# EAGLE schematic DeMux3 (EAGLE 6.6.0)

## Sheet 1 of 3
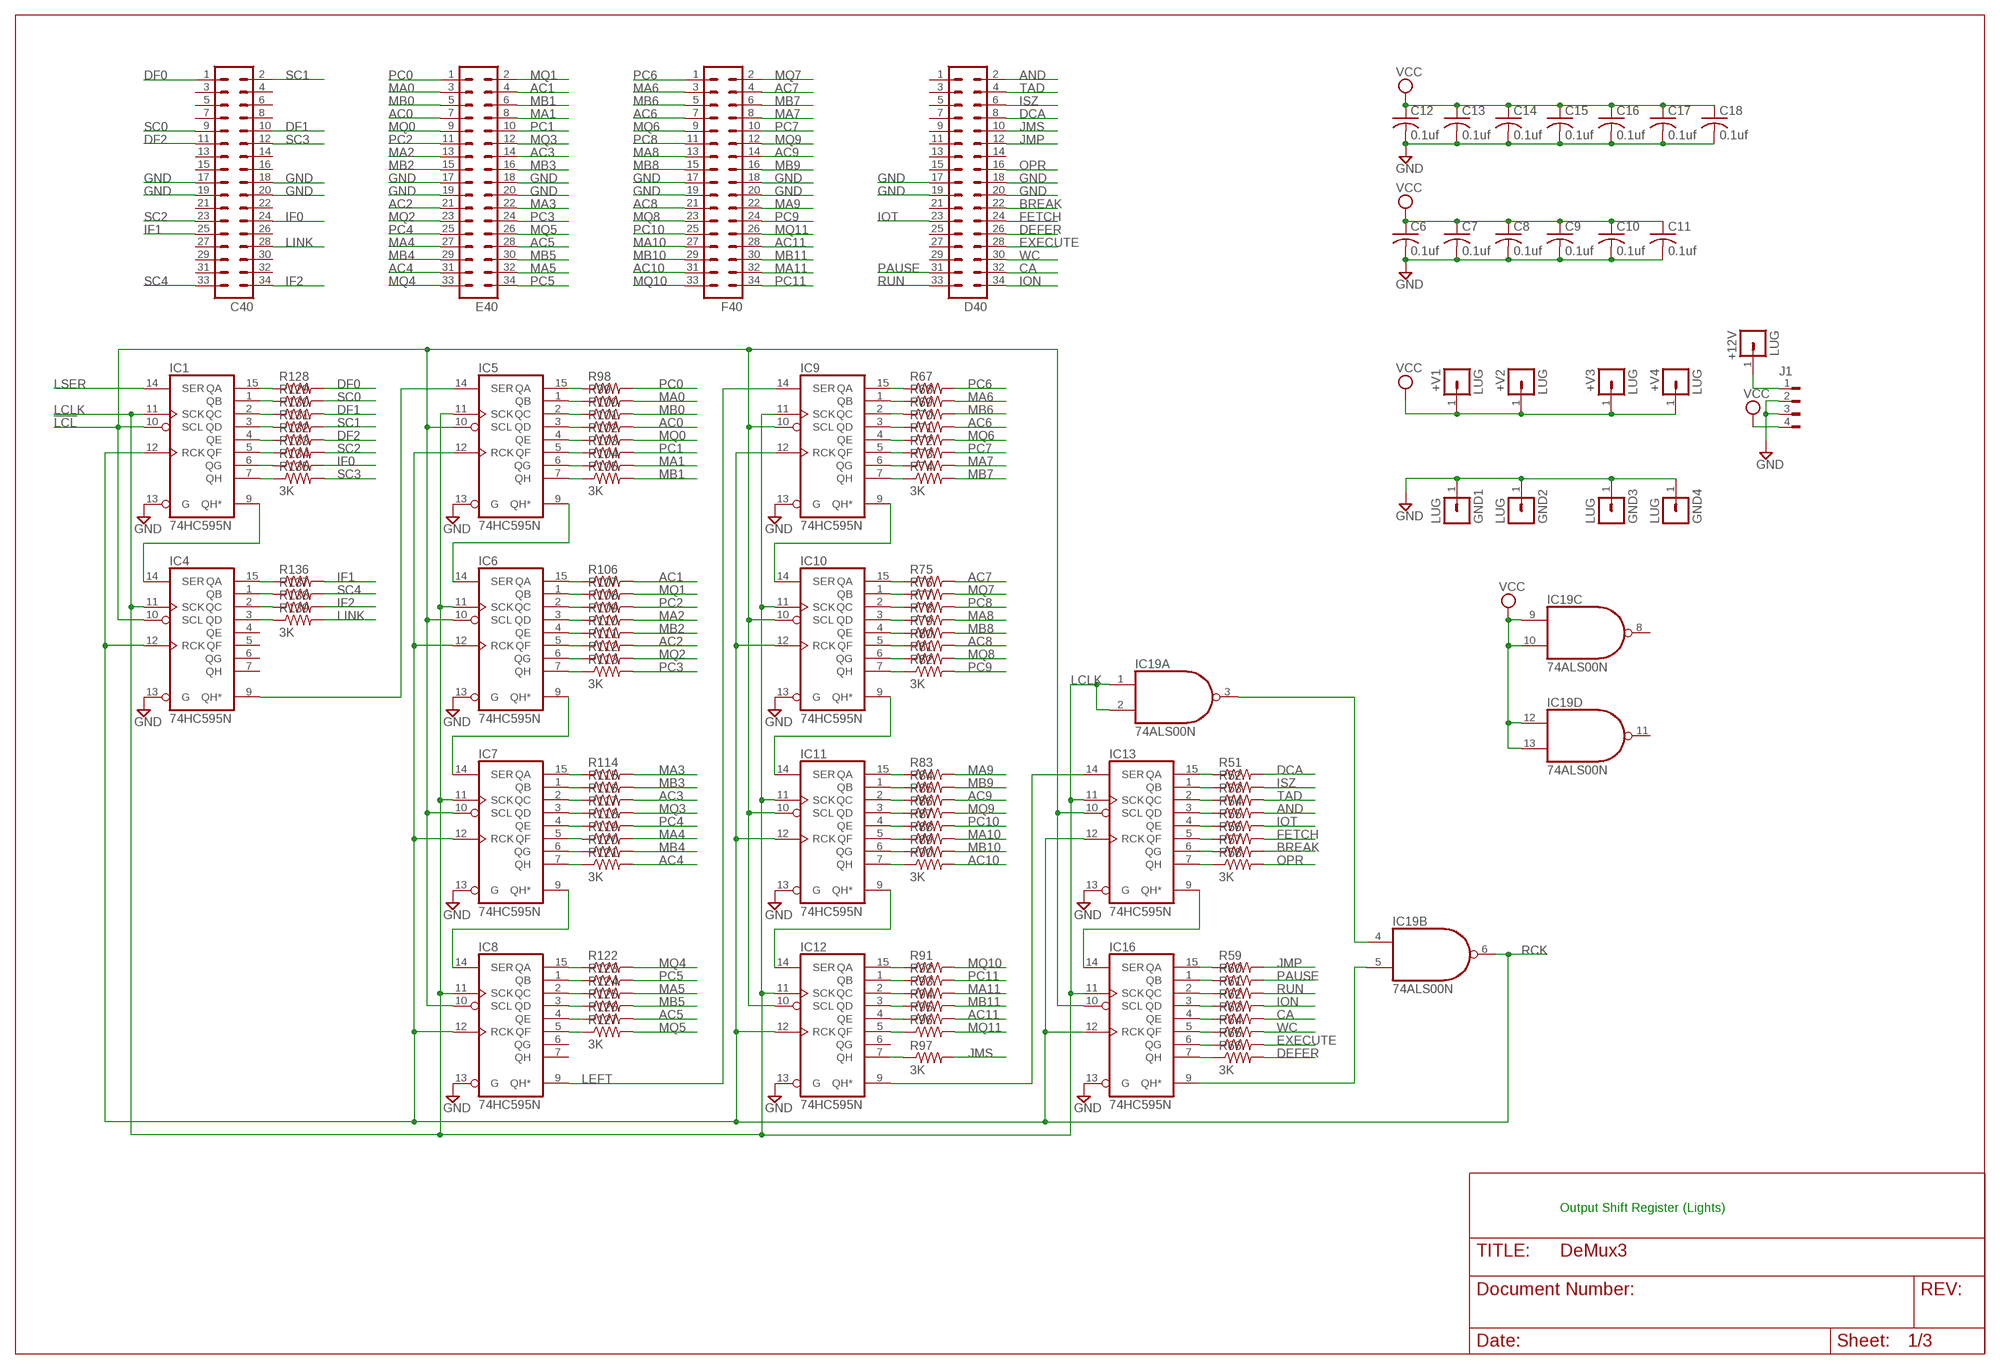
[diagram p0: schematic, sheet 1]

### Parts
+12V  LUG  [SPADELUG]
+V1  LUG  [SPADELUG]
+V2  LUG  [SPADELUG]
+V3  LUG  [SPADELUG]
+V4  LUG  [SPADELUG]
C6  0.1uf  C-US050-025X075  [C050-025X075]
C7  0.1uf  C-US050-025X075  [C050-025X075]
C8  0.1uf  C-US050-025X075  [C050-025X075]
C9  0.1uf  C-US050-025X075  [C050-025X075]
C10  0.1uf  C-US050-025X075  [C050-025X075]
C11  0.1uf  C-US050-025X075  [C050-025X075]
C12  0.1uf  C-US050-025X075  [C050-025X075]
C13  0.1uf  C-US050-025X075  [C050-025X075]
C14  0.1uf  C-US050-025X075  [C050-025X075]
C15  0.1uf  C-US050-025X075  [C050-025X075]
C16  0.1uf  C-US050-025X075  [C050-025X075]
C17  0.1uf  C-US050-025X075  [C050-025X075]
C18  0.1uf  C-US050-025X075  [C050-025X075]
C40  MA17-2  [MA17-2]
D40  MA17-2  [MA17-2]
E40  MA17-2  [MA17-2]
F40  MA17-2  [MA17-2]
GND1  LUG  [SPADELUG]
GND2  LUG  [SPADELUG]
GND3  LUG  [SPADELUG]
GND4  LUG  [SPADELUG]
IC1  74HC595N  74LS595N  [DIL16]
IC4  74HC595N  74LS595N  [DIL16]
IC5  74HC595N  74LS595N  [DIL16]
IC6  74HC595N  74LS595N  [DIL16]
IC7  74HC595N  74LS595N  [DIL16]
IC8  74HC595N  74LS595N  [DIL16]
IC9  74HC595N  74LS595N  [DIL16]
IC10  74HC595N  74LS595N  [DIL16]
IC11  74HC595N  74LS595N  [DIL16]
IC12  74HC595N  74LS595N  [DIL16]
IC13  74HC595N  74LS595N  [DIL16]
IC16  74HC595N  74LS595N  [DIL16]
IC19  74ALS00N  [DIL14]
J1  FLOPPY-4  [FLOPPY-4]
R51  R-US_0207/10  [0207/10]
R52  R-US_0207/10  [0207/10]
R53  R-US_0207/10  [0207/10]
R54  R-US_0207/10  [0207/10]
R55  R-US_0207/10  [0207/10]
R56  R-US_0207/10  [0207/10]
R57  R-US_0207/10  [0207/10]
R58  3K  R-US_0207/10  [0207/10]
R59  R-US_0207/10  [0207/10]
R60  R-US_0207/10  [0207/10]
R61  R-US_0207/10  [0207/10]
R62  R-US_0207/10  [0207/10]
R63  R-US_0207/10  [0207/10]
R64  R-US_0207/10  [0207/10]
R65  R-US_0207/10  [0207/10]
R66  3K  R-US_0207/10  [0207/10]
R67  R-US_0207/10  [0207/10]
R68  R-US_0207/10  [0207/10]
R69  R-US_0207/10  [0207/10]
R70  R-US_0207/10  [0207/10]
R71  R-US_0207/10  [0207/10]
R72  R-US_0207/10  [0207/10]
R73  R-US_0207/10  [0207/10]
R74  3K  R-US_0207/10  [0207/10]
R75  R-US_0207/10  [0207/10]
R76  R-US_0207/10  [0207/10]
R77  R-US_0207/10  [0207/10]
R78  R-US_0207/10  [0207/10]
R79  R-US_0207/10  [0207/10]
R80  R-US_0207/10  [0207/10]
R81  R-US_0207/10  [0207/10]
R82  3K  R-US_0207/10  [0207/10]
R83  R-US_0207/10  [0207/10]
R84  R-US_0207/10  [0207/10]
R85  R-US_0207/10  [0207/10]
R86  R-US_0207/10  [0207/10]
R87  R-US_0207/10  [0207/10]
R88  R-US_0207/10  [0207/10]
R89  R-US_0207/10  [0207/10]
R90  3K  R-US_0207/10  [0207/10]
R91  R-US_0207/10  [0207/10]
R92  R-US_0207/10  [0207/10]
R93  R-US_0207/10  [0207/10]
R94  R-US_0207/10  [0207/10]
R95  R-US_0207/10  [0207/10]
R96  R-US_0207/10  [0207/10]
R97  3K  R-US_0207/10  [0207/10]
R98  R-US_0207/10  [0207/10]
R99  R-US_0207/10  [0207/10]
R100  R-US_0207/10  [0207/10]
R101  R-US_0207/10  [0207/10]
R102  R-US_0207/10  [0207/10]
R103  R-US_0207/10  [0207/10]
R104  R-US_0207/10  [0207/10]
R105  3K  R-US_0207/10  [0207/10]
R106  R-US_0207/10  [0207/10]
R107  R-US_0207/10  [0207/10]
R108  R-US_0207/10  [0207/10]
R109  R-US_0207/10  [0207/10]
R110  R-US_0207/10  [0207/10]
R111  R-US_0207/10  [0207/10]
R112  R-US_0207/10  [0207/10]
R113  3K  R-US_0207/10  [0207/10]
R114  R-US_0207/10  [0207/10]
R115  R-US_0207/10  [0207/10]
R116  R-US_0207/10  [0207/10]
R117  R-US_0207/10  [0207/10]
R118  R-US_0207/10  [0207/10]
R119  R-US_0207/10  [0207/10]
R120  R-US_0207/10  [0207/10]
R121  3K  R-US_0207/10  [0207/10]
R122  R-US_0207/10  [0207/10]
R123  R-US_0207/10  [0207/10]
R124  R-US_0207/10  [0207/10]
R125  R-US_0207/10  [0207/10]
R126  R-US_0207/10  [0207/10]
R127  3K  R-US_0207/10  [0207/10]
R128  R-US_0207/10  [0207/10]
R129  R-US_0207/10  [0207/10]
R130  R-US_0207/10  [0207/10]
R131  R-US_0207/10  [0207/10]
R132  R-US_0207/10  [0207/10]
R133  R-US_0207/10  [0207/10]
R134  R-US_0207/10  [0207/10]
R135  3K  R-US_0207/10  [0207/10]
R136  R-US_0207/10  [0207/10]
R137  R-US_0207/10  [0207/10]
R138  R-US_0207/10  [0207/10]
R139  3K  R-US_0207/10  [0207/10]

### Nets
!LCL: IC1.10(SCL) IC4.10(SCL) IC5.10(SCL) IC6.10(SCL) IC7.10(SCL) IC8.10(SCL) IC9.10(SCL) IC10.10(SCL) IC11.10(SCL) IC12.10(SCL) IC13.10(SCL) IC16.10(SCL) ; also sheet 3
+12V [supply]: +12V.1 J1.1
AC0: E40.7 R101.2
AC1: E40.4 R106.2
AC2: E40.21 R111.2
AC3: E40.14 R116.2
AC4: E40.31 R121.2
AC5: E40.28 R126.2
AC6: F40.7 R70.2
AC7: F40.4 R75.2
AC8: F40.21 R80.2
AC9: F40.14 R85.2
AC10: F40.31 R90.2
AC11: F40.28 R95.2
AND: D40.2 R54.2
BREAK: D40.22 R57.2
CA: D40.32 R63.2
DCA: D40.8 R51.2
DEFER: D40.26 R66.2
DF0: C40.1 R128.2
DF1: C40.10 R130.2
DF2: C40.11 R132.2
EXECUTE: D40.28 R65.2
FETCH: D40.24 R56.2
GND [supply]: C6.2 C7.2 C8.2 C9.2 C10.2 C11.2 C12.2 C13.2 C14.2 C15.2 C16.2 C17.2 C18.2 C40.17 C40.18 C40.19 C40.20 D40.17 D40.18 D40.19 D40.20 E40.17 E40.18 E40.19 E40.20 F40.17 F40.18 F40.19 F40.20 GND1.1 GND2.1 GND3.1 GND4.1 IC1.13(G) IC4.13(G) IC5.13(G) IC6.13(G) IC7.13(G) IC8.13(G) IC9.13(G) IC10.13(G) IC11.13(G) IC12.13(G) IC13.13(G) IC16.13(G) J1.2 J1.3 ; also sheet 2,3
IF0: C40.24 R134.2
IF1: C40.25 R136.2
IF2: C40.34 R138.2
ION: D40.34 R62.2
IOT: D40.23 R55.2
ISZ: D40.6 R52.2
JMP: D40.12 R59.2
JMS: D40.10 R97.2
LCLK: IC1.11(SCK) IC4.11(SCK) IC5.11(SCK) IC6.11(SCK) IC7.11(SCK) IC8.11(SCK) IC9.11(SCK) IC10.11(SCK) IC11.11(SCK) IC12.11(SCK) IC13.11(SCK) IC16.11(SCK) IC19.1(A:I0) IC19.2(A:I1) ; also sheet 3
LEFT: IC8.9(QH*) IC9.14(SER) ; also sheet 3
LINK: C40.28 R139.2
LSER: IC1.14(SER) ; also sheet 3
MA0: E40.3 R99.2
MA1: E40.8 R104.2
MA2: E40.13 R109.2
MA3: E40.22 R114.2
MA4: E40.27 R119.2
MA5: E40.32 R124.2
MA6: F40.3 R68.2
MA7: F40.8 R73.2
MA8: F40.13 R78.2
MA9: F40.22 R83.2
MA10: F40.27 R88.2
MA11: F40.32 R93.2
MB0: E40.5 R100.2
MB1: E40.6 R105.2
MB2: E40.15 R110.2
MB3: E40.16 R115.2
MB4: E40.29 R120.2
MB5: E40.30 R125.2
MB6: F40.5 R69.2
MB7: F40.6 R74.2
MB8: F40.15 R79.2
MB9: F40.16 R84.2
MB10: F40.29 R89.2
MB11: F40.30 R94.2
MQ0: E40.9 R102.2
MQ1: E40.2 R107.2
MQ2: E40.23 R112.2
MQ3: E40.12 R117.2
MQ4: E40.33 R122.2
MQ5: E40.26 R127.2
MQ6: F40.9 R71.2
MQ7: F40.2 R76.2
MQ8: F40.23 R81.2
MQ9: F40.12 R86.2
MQ10: F40.33 R91.2
MQ11: F40.26 R96.2
N$4: IC5.9(QH*) IC6.14(SER)
N$10: IC1.9(QH*) IC4.14(SER)
N$13: IC7.9(QH*) IC8.14(SER)
N$14: IC6.9(QH*) IC7.14(SER)
N$15: IC11.9(QH*) IC12.14(SER)
N$16: IC10.9(QH*) IC11.14(SER)
N$17: IC13.9(QH*) IC16.14(SER)
N$19: IC9.9(QH*) IC10.14(SER)
N$21: IC4.9(QH*) IC5.14(SER)
N$22: IC16.9(QH*) IC19.5(B:I1)
N$23: IC12.9(QH*) IC13.14(SER)
N$24: IC13.15(QA) R51.1
N$25: IC13.1(QB) R52.1
N$26: IC13.2(QC) R53.1
N$27: IC19.3(A:O) IC19.4(B:I0)
N$32: IC13.3(QD) R54.1
N$33: IC13.4(QE) R55.1
N$34: IC13.5(QF) R56.1
N$35: IC13.6(QG) R57.1
N$36: IC13.7(QH) R58.1
N$37: IC16.15(QA) R59.1
N$38: IC16.1(QB) R60.1
N$39: IC16.2(QC) R61.1
N$40: IC16.3(QD) R62.1
N$41: IC16.4(QE) R63.1
N$42: IC16.5(QF) R64.1
N$43: IC16.6(QG) R65.1
N$44: IC16.7(QH) R66.1
N$45: IC9.15(QA) R67.1
N$46: IC9.1(QB) R68.1
N$47: IC9.2(QC) R69.1
N$48: IC9.3(QD) R70.1
N$49: IC9.4(QE) R71.1
N$50: IC9.5(QF) R72.1
N$51: IC9.6(QG) R73.1
N$57: IC9.7(QH) R74.1
N$58: IC12.7(QH) R97.1
N$59: IC12.5(QF) R96.1
N$60: IC12.4(QE) R95.1
N$61: IC12.3(QD) R94.1
N$62: IC12.2(QC) R93.1
N$63: IC12.1(QB) R92.1
N$64: IC12.15(QA) R91.1
N$65: IC10.15(QA) R75.1
N$66: IC10.1(QB) R76.1
N$67: IC10.2(QC) R77.1
N$68: IC10.3(QD) R78.1
N$69: IC10.4(QE) R79.1
N$70: IC10.5(QF) R80.1
N$71: IC10.6(QG) R81.1
N$72: IC10.7(QH) R82.1
N$73: IC11.15(QA) R83.1
N$74: IC11.1(QB) R84.1
N$75: IC11.3(QD) R86.1
N$76: IC11.2(QC) R85.1
N$77: IC11.4(QE) R87.1
N$78: IC11.5(QF) R88.1
N$79: IC11.6(QG) R89.1
N$80: IC11.7(QH) R90.1
N$81: IC8.5(QF) R127.1
N$82: IC8.4(QE) R126.1
N$83: IC8.3(QD) R125.1
N$84: IC8.2(QC) R124.1
N$85: IC8.1(QB) R123.1
N$86: IC8.15(QA) R122.1
N$87: IC7.7(QH) R121.1
N$88: IC7.6(QG) R120.1
N$89: IC7.5(QF) R119.1
N$90: IC7.4(QE) R118.1
N$91: IC7.3(QD) R117.1
N$92: IC7.2(QC) R116.1
N$93: IC7.1(QB) R115.1
N$94: IC7.15(QA) R114.1
N$95: IC5.15(QA) R98.1
N$96: IC5.1(QB) R99.1
N$97: IC5.2(QC) R100.1
N$98: IC5.3(QD) R101.1
N$99: IC5.4(QE) R102.1
N$100: IC5.5(QF) R103.1
N$101: IC5.6(QG) R104.1
N$102: IC5.7(QH) R105.1
N$103: IC6.15(QA) R106.1
N$104: IC6.1(QB) R107.1
N$105: IC6.2(QC) R108.1
N$106: IC6.3(QD) R109.1
N$107: IC6.4(QE) R110.1
N$108: IC6.5(QF) R111.1
N$109: IC6.6(QG) R112.1
N$110: IC6.7(QH) R113.1
N$111: IC1.15(QA) R128.1
N$112: IC1.1(QB) R129.1
N$113: IC1.2(QC) R130.1
N$114: IC1.3(QD) R131.1
N$115: IC1.4(QE) R132.1
N$116: IC1.5(QF) R133.1
N$117: IC1.6(QG) R134.1
N$118: IC1.7(QH) R135.1
N$119: IC4.15(QA) R136.1
N$120: IC4.3(QD) R139.1
N$121: IC4.2(QC) R138.1
N$122: IC4.1(QB) R137.1
OPR: D40.16 R58.2
PAUSE: D40.31 R60.2
PC0: E40.1 R98.2
PC1: E40.10 R103.2
PC2: E40.11 R108.2
PC3: E40.24 R113.2
PC4: E40.25 R118.2
PC5: E40.34 R123.2
PC6: F40.1 R67.2
PC7: F40.10 R72.2
PC8: F40.11 R77.2
PC9: F40.24 R82.2
PC10: F40.25 R87.2
PC11: F40.34 R92.2
RCK: IC1.12(RCK) IC4.12(RCK) IC5.12(RCK) IC6.12(RCK) IC7.12(RCK) IC8.12(RCK) IC9.12(RCK) IC10.12(RCK) IC11.12(RCK) IC12.12(RCK) IC13.12(RCK) IC16.12(RCK) IC19.6(B:O) ; also sheet 3
RUN: D40.33 R61.2
SC0: C40.9 R129.2
SC1: C40.2 R131.2
SC2: C40.23 R133.2
SC3: C40.12 R135.2
SC4: C40.33 R137.2
TAD: D40.4 R53.2
VCC [supply]: +V1.1 +V2.1 +V3.1 +V4.1 C6.1 C7.1 C8.1 C9.1 C10.1 C11.1 C12.1 C13.1 C14.1 C15.1 C16.1 C17.1 C18.1 IC19.9(C:I0) IC19.10(C:I1) IC19.12(D:I0) IC19.13(D:I1) J1.4 ; also sheet 2,3
WC: D40.30 R64.2
Unconnected: C40.3 C40.4 C40.5 C40.6 C40.7 C40.8 C40.13 C40.14 C40.15 C40.16 C40.21 C40.22 C40.26 C40.27 C40.29 C40.30 C40.31 C40.32 D40.1 D40.3 D40.5 D40.7 D40.9 D40.11 D40.13 D40.14 D40.15 D40.21 D40.25 D40.27 D40.29 IC4.4(QE) IC4.5(QF) IC4.6(QG) IC4.7(QH) IC8.6(QG) IC8.7(QH) IC12.6(QG) IC19.8(C:O) IC19.11(D:O)

### Notes on the sheet
- Output Shift Register (Lights)

## Sheet 2 of 3
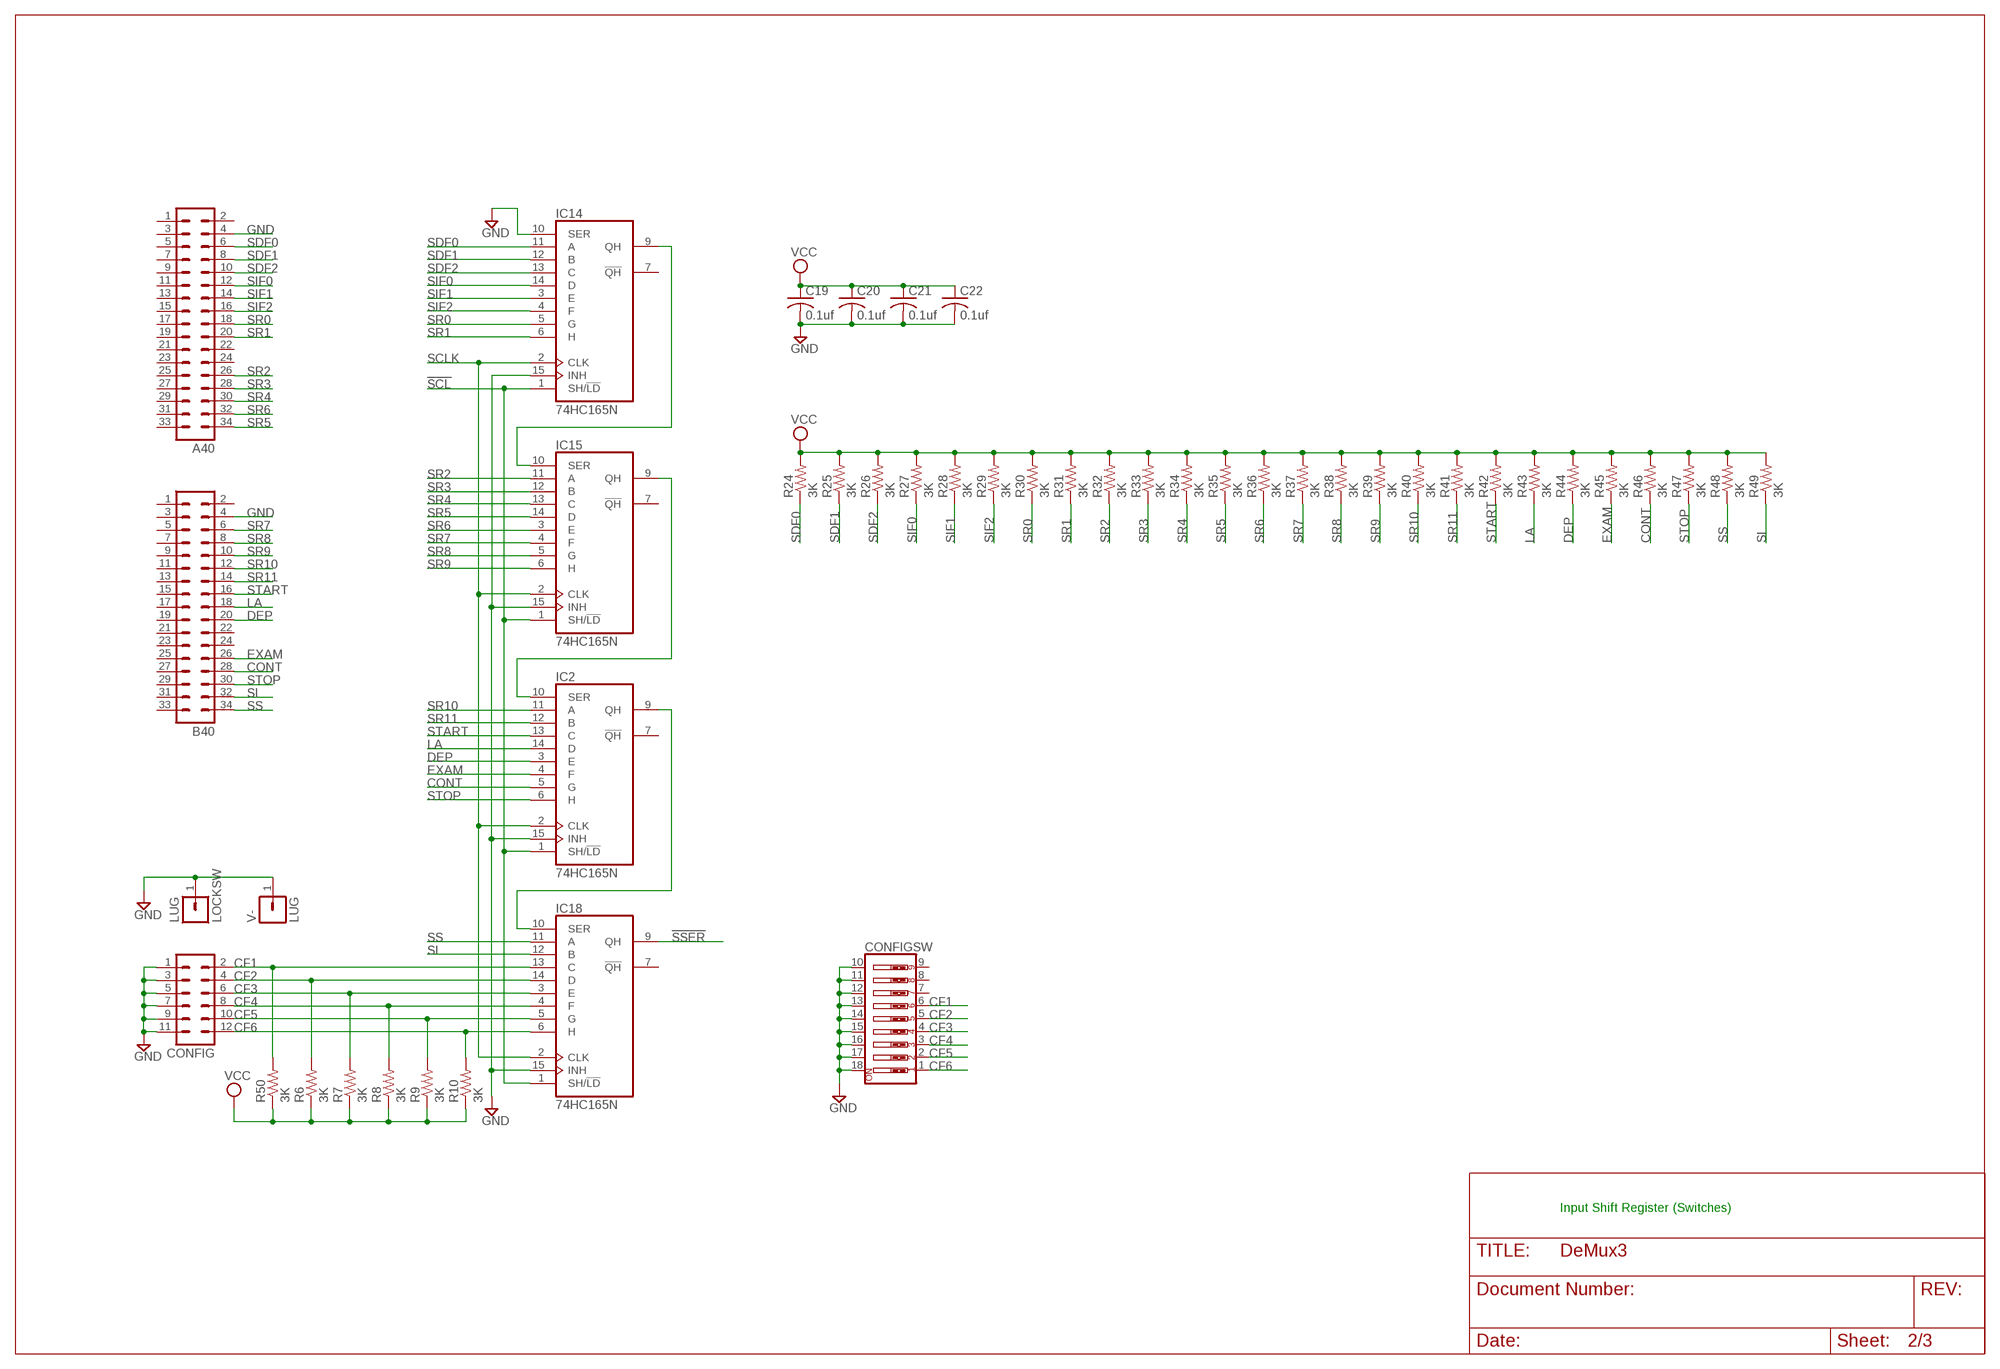
[diagram p1: schematic, sheet 2]

### Parts
A40  MA17-2  [MA17-2]
B40  MA17-2  [MA17-2]
C19  0.1uf  C-US050-025X075  [C050-025X075]
C20  0.1uf  C-US050-025X075  [C050-025X075]
C21  0.1uf  C-US050-025X075  [C050-025X075]
C22  0.1uf  C-US050-025X075  [C050-025X075]
CONFIG  MA06-2  [MA06-2]
CONFIGSW  SW_DIP-9  [EDG-09]
IC2  74HC165N  74LS165N  [DIL16]
IC14  74HC165N  74LS165N  [DIL16]
IC15  74HC165N  74LS165N  [DIL16]
IC18  74HC165N  74LS165N  [DIL16]
LOCKSW  LUG  [SPADELUG]
R6  3K  R-US_0207/10  [0207/10]
R7  3K  R-US_0207/10  [0207/10]
R8  3K  R-US_0207/10  [0207/10]
R9  3K  R-US_0207/10  [0207/10]
R10  3K  R-US_0207/10  [0207/10]
R24  3K  R-US_0207/10  [0207/10]
R25  3K  R-US_0207/10  [0207/10]
R26  3K  R-US_0207/10  [0207/10]
R27  3K  R-US_0207/10  [0207/10]
R28  3K  R-US_0207/10  [0207/10]
R29  3K  R-US_0207/10  [0207/10]
R30  3K  R-US_0207/10  [0207/10]
R31  3K  R-US_0207/10  [0207/10]
R32  3K  R-US_0207/10  [0207/10]
R33  3K  R-US_0207/10  [0207/10]
R34  3K  R-US_0207/10  [0207/10]
R35  3K  R-US_0207/10  [0207/10]
R36  3K  R-US_0207/10  [0207/10]
R37  3K  R-US_0207/10  [0207/10]
R38  3K  R-US_0207/10  [0207/10]
R39  3K  R-US_0207/10  [0207/10]
R40  3K  R-US_0207/10  [0207/10]
R41  3K  R-US_0207/10  [0207/10]
R42  3K  R-US_0207/10  [0207/10]
R43  3K  R-US_0207/10  [0207/10]
R44  3K  R-US_0207/10  [0207/10]
R45  3K  R-US_0207/10  [0207/10]
R46  3K  R-US_0207/10  [0207/10]
R47  3K  R-US_0207/10  [0207/10]
R48  3K  R-US_0207/10  [0207/10]
R49  3K  R-US_0207/10  [0207/10]
R50  3K  R-US_0207/10  [0207/10]
V-  LUG  [SPADELUG]

### Nets
!SCL: IC2.1(SH/!LD) IC14.1(SH/!LD) IC15.1(SH/!LD) IC18.1(SH/!LD) ; also sheet 3
!SSER: IC18.9(QH) ; also sheet 3
CF1: CONFIG.2 CONFIGSW.6 IC18.13(C) R50.2
CF2: CONFIG.4 CONFIGSW.5 IC18.14(D) R6.2
CF3: CONFIG.6 CONFIGSW.4 IC18.3(E) R7.2
CF4: CONFIG.8 CONFIGSW.3 IC18.4(F) R8.2
CF5: CONFIG.10 CONFIGSW.2 IC18.5(G) R9.2
CF6: CONFIG.12 CONFIGSW.1 IC18.6(H) R10.2
CONT: B40.28 IC2.5(G) R46.1
DEP: B40.20 IC2.3(E) R44.1
EXAM: B40.26 IC2.4(F) R45.1
GND [supply]: A40.4 B40.4 C19.2 C20.2 C21.2 C22.2 CONFIG.1 CONFIG.3 CONFIG.5 CONFIG.7 CONFIG.9 CONFIG.11 CONFIGSW.10 CONFIGSW.11 CONFIGSW.12 CONFIGSW.13 CONFIGSW.14 CONFIGSW.15 CONFIGSW.16 CONFIGSW.17 CONFIGSW.18 IC2.15(INH) IC14.10(SER) IC14.15(INH) IC15.15(INH) IC18.15(INH) LOCKSW.1 V-.1 ; also sheet 1,3
LA: B40.18 IC2.14(D) R43.1
N$1: IC14.9(QH) IC15.10(SER)
N$2: IC2.10(SER) IC15.9(QH)
N$3: IC2.9(QH) IC18.10(SER)
SCLK: IC2.2(CLK) IC14.2(CLK) IC15.2(CLK) IC18.2(CLK) ; also sheet 3
SDF0: A40.6 IC14.11(A) R24.1
SDF1: A40.8 IC14.12(B) R25.1
SDF2: A40.10 IC14.13(C) R26.1
SI: B40.32 IC18.12(B) R49.1
SIF0: A40.12 IC14.14(D) R27.1
SIF1: A40.14 IC14.3(E) R28.1
SIF2: A40.16 IC14.4(F) R29.1
SR0: A40.18 IC14.5(G) R30.1
SR1: A40.20 IC14.6(H) R31.1
SR2: A40.26 IC15.11(A) R32.1
SR3: A40.28 IC15.12(B) R33.1
SR4: A40.30 IC15.13(C) R34.1
SR5: A40.34 IC15.14(D) R35.1
SR6: A40.32 IC15.3(E) R36.1
SR7: B40.6 IC15.4(F) R37.1
SR8: B40.8 IC15.5(G) R38.1
SR9: B40.10 IC15.6(H) R39.1
SR10: B40.12 IC2.11(A) R40.1
SR11: B40.14 IC2.12(B) R41.1
SS: B40.34 IC18.11(A) R48.1
START: B40.16 IC2.13(C) R42.1
STOP: B40.30 IC2.6(H) R47.1
VCC [supply]: C19.1 C20.1 C21.1 C22.1 R6.1 R7.1 R8.1 R9.1 R10.1 R24.2 R25.2 R26.2 R27.2 R28.2 R29.2 R30.2 R31.2 R32.2 R33.2 R34.2 R35.2 R36.2 R37.2 R38.2 R39.2 R40.2 R41.2 R42.2 R43.2 R44.2 R45.2 R46.2 R47.2 R48.2 R49.2 R50.1 ; also sheet 1,3
Unconnected: A40.1 A40.2 A40.3 A40.5 A40.7 A40.9 A40.11 A40.13 A40.15 A40.17 A40.19 A40.21 A40.22 A40.23 A40.24 A40.25 A40.27 A40.29 A40.31 A40.33 B40.1 B40.2 B40.3 B40.5 B40.7 B40.9 B40.11 B40.13 B40.15 B40.17 B40.19 B40.21 B40.22 B40.23 B40.24 B40.25 B40.27 B40.29 B40.31 B40.33 CONFIGSW.7 CONFIGSW.8 CONFIGSW.9 IC2.7(!QH) IC14.7(!QH) IC15.7(!QH) IC18.7(!QH)

### Notes on the sheet
- Input Shift Register (Switches)

## Sheet 3 of 3
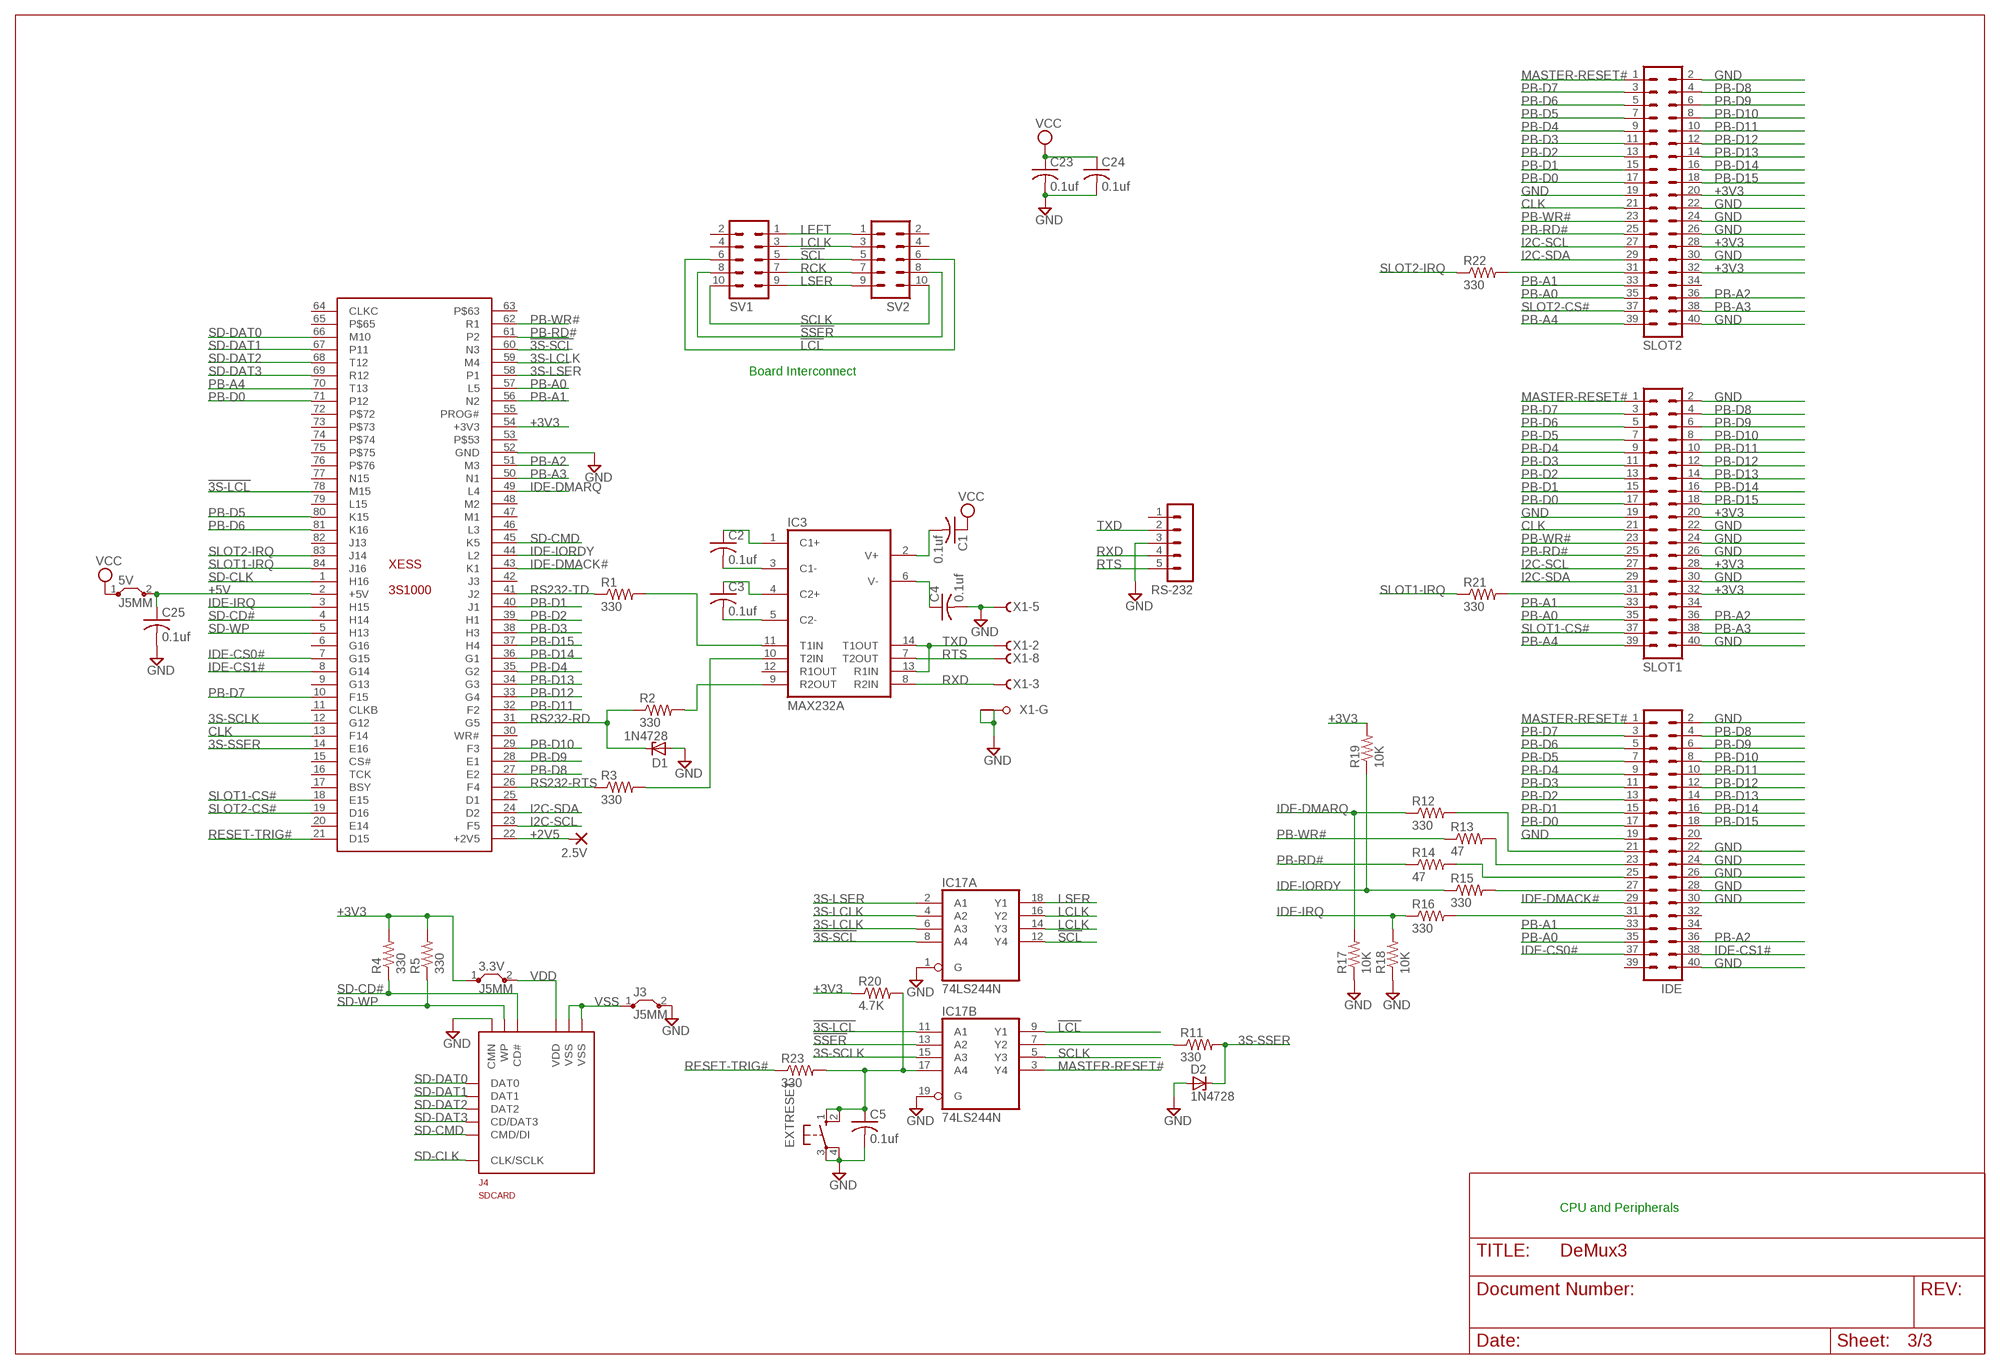
[diagram p2: schematic, sheet 3]

### Parts
2.5V  1,6/0,8  [1,6/0,8]
3.3V  J5MM  [05]
5V  J5MM  [05]
C1  0.1uf  C-US050-025X075  [C050-025X075]
C2  0.1uf  C-US050-025X075  [C050-025X075]
C3  0.1uf  C-US050-025X075  [C050-025X075]
C4  0.1uf  C-US050-025X075  [C050-025X075]
C5  0.1uf  C-US050-025X075  [C050-025X075]
C23  0.1uf  C-US050-025X075  [C050-025X075]
C24  0.1uf  C-US050-025X075  [C050-025X075]
C25  0.1uf  C-US050-025X075  [C050-025X075]
D1  1N4728  [DO41Z10]
D2  1N4728  [DO41Z10]
EXTRESET  40-XX  [B3F-40XX]
IC3  MAX232A  MAX232  [DIL16]
IC17  74LS244N  [DIL20]
IDE  MA20-2  [MA20-2]
J3  J5MM  [05]
J4  SDCARD  [SCDA5A]
R1  330  R-US_0207/10  [0207/10]
R2  330  R-US_0207/10  [0207/10]
R3  330  R-US_0207/10  [0207/10]
R4  330  R-US_0207/10  [0207/10]
R5  330  R-US_0207/10  [0207/10]
R11  330  R-US_0207/10  [0207/10]
R12  330  R-US_0207/10  [0207/10]
R13  47  R-US_0207/10  [0207/10]
R14  47  R-US_0207/10  [0207/10]
R15  330  R-US_0207/10  [0207/10]
R16  330  R-US_0207/10  [0207/10]
R17  10K  R-US_0207/10  [0207/10]
R18  10K  R-US_0207/10  [0207/10]
R19  10K  R-US_0207/10  [0207/10]
R20  4.7K  R-US_0207/10  [0207/10]
R21  330  R-US_0207/10  [0207/10]
R22  330  R-US_0207/10  [0207/10]
R23  330  R-US_0207/10  [0207/10]
RS-232  MA05-1  [MA05-1]
SLOT1  MA20-2  [MA20-2]
SLOT2  MA20-2  [MA20-2]
SV1  MA05-2  [MA05-2]
SV2  MA05-2  [MA05-2]
X1  F09HPS  [F09HP]
XESS  3S1000  [3S1000]

### Nets
3S-LCLK: IC17.4(A:A2) IC17.6(A:A3) XESS.59(M4)
3S-LSER: IC17.2(A:A1) XESS.58(P1)
3S-SCLK: IC17.15(B:A3) XESS.12(G12)
3S-SSER: D2.C R11.2 XESS.14(E16)
!3S-LCL: IC17.11(B:A1) XESS.78(M15)
!3S-SCL: IC17.8(A:A4) XESS.60(N3)
!LCL: IC17.9(B:Y1) SV1.6 SV2.6 ; also sheet 1
!SCL: IC17.12(A:Y4) SV1.5 SV2.5 ; also sheet 2
!SSER: IC17.13(B:A2) SV1.8 SV2.8 ; also sheet 2
+2V5 [supply]: 2.5V.1(P) XESS.22(+2V5)
+3V3 [supply]: 3.3V.1 R4.2 R5.2 R19.2 R20.1 SLOT1.20 SLOT1.28 SLOT1.32 SLOT2.20 SLOT2.28 SLOT2.32 XESS.54(+3V3)
+5V [supply]: 5V.2 C25.1 XESS.2(+5V)
CLK: SLOT1.21 SLOT2.21 XESS.13(F14)
GND [supply]: C4.2 C5.2 C23.2 C24.2 C25.2 D1.A D2.A EXTRESET.3(P) EXTRESET.4(P1) IC17.1(A:G) IC17.19(B:G) IDE.2 IDE.19 IDE.22 IDE.24 IDE.26 IDE.28 IDE.30 IDE.40 J3.2 J4.11(CMN) R17.1 R18.1 RS-232.3 SLOT1.2 SLOT1.19 SLOT1.22 SLOT1.24 SLOT1.26 SLOT1.30 SLOT1.40 SLOT2.2 SLOT2.19 SLOT2.22 SLOT2.24 SLOT2.26 SLOT2.30 SLOT2.40 X1.5(-5:F) X1.G1(-G:G1) X1.G2(-G:G2) XESS.52(GND) ; also sheet 1,2
I2C-SCL: SLOT1.27 SLOT2.27 XESS.23(F5)
I2C-SDA: SLOT1.29 SLOT2.29 XESS.24(D2)
IDE-CS0#: IDE.37 XESS.7(G15)
IDE-CS1#: IDE.38 XESS.8(G14)
IDE-DMACK#: IDE.29 XESS.43(K1)
IDE-DMARQ: R12.1 R17.2 XESS.49(L4)
IDE-IORDY: R15.1 R19.1 XESS.44(L2)
IDE-IRQ: R16.1 R18.2 XESS.3(H15)
LCLK: IC17.14(A:Y3) IC17.16(A:Y2) SV1.3 SV2.3 ; also sheet 1
LEFT: SV1.1 SV2.1 ; also sheet 1
LSER: IC17.18(A:Y1) SV1.9 SV2.9 ; also sheet 1
MASTER-RESET#: IC17.3(B:Y4) IDE.1 SLOT1.1 SLOT2.1
N$5: IC3.10(T2IN) R3.2
N$6: IC3.11(T1IN) R1.2
N$7: IC3.9(R2OUT) R2.2
N$8: C1.2 IC3.2(V+)
N$9: C2.2 IC3.3(C1-)
N$11: C2.1 IC3.1(C1+)
N$12: C4.1 IC3.6(V-)
N$18: C3.1 IC3.4(C2+)
N$20: C3.2 IC3.5(C2-)
N$28: IC17.7(B:Y2) R11.1
N$29: R21.2 SLOT1.31
N$30: R22.2 SLOT2.31
N$31: C5.1 EXTRESET.1(S) EXTRESET.2(S1) IC17.17(B:A4) R20.2 R23.2
N$52: IDE.31 R16.2
N$53: IDE.27 R15.2
N$54: IDE.25 R14.2
N$55: IDE.23 R13.2
N$56: IDE.21 R12.2
PB-A0: IDE.35 SLOT1.35 SLOT2.35 XESS.57(L5)
PB-A1: IDE.33 SLOT1.33 SLOT2.33 XESS.56(N2)
PB-A2: IDE.36 SLOT1.36 SLOT2.36 XESS.51(M3)
PB-A3: SLOT1.38 SLOT2.38 XESS.50(N1)
PB-A4: SLOT1.39 SLOT2.39 XESS.70(T13)
PB-D0: IDE.17 SLOT1.17 SLOT2.17 XESS.71(P12)
PB-D1: IDE.15 SLOT1.15 SLOT2.15 XESS.40(J1)
PB-D2: IDE.13 SLOT1.13 SLOT2.13 XESS.39(H1)
PB-D3: IDE.11 SLOT1.11 SLOT2.11 XESS.38(H3)
PB-D4: IDE.9 SLOT1.9 SLOT2.9 XESS.35(G2)
PB-D5: IDE.7 SLOT1.7 SLOT2.7 XESS.80(K15)
PB-D6: IDE.5 SLOT1.5 SLOT2.5 XESS.81(K16)
PB-D7: IDE.3 SLOT1.3 SLOT2.3 XESS.10(F15)
PB-D8: IDE.4 SLOT1.4 SLOT2.4 XESS.27(E2)
PB-D9: IDE.6 SLOT1.6 SLOT2.6 XESS.28(E1)
PB-D10: IDE.8 SLOT1.8 SLOT2.8 XESS.29(F3)
PB-D11: IDE.10 SLOT1.10 SLOT2.10 XESS.32(F2)
PB-D12: IDE.12 SLOT1.12 SLOT2.12 XESS.33(G4)
PB-D13: IDE.14 SLOT1.14 SLOT2.14 XESS.34(G3)
PB-D14: IDE.16 SLOT1.16 SLOT2.16 XESS.36(G1)
PB-D15: IDE.18 SLOT1.18 SLOT2.18 XESS.37(H4)
PB-RD#: R14.1 SLOT1.25 SLOT2.25 XESS.61(P2)
PB-WR#: R13.1 SLOT1.23 SLOT2.23 XESS.62(R1)
RCK: SV1.7 SV2.7 ; also sheet 1
RESET-TRIG#: R23.1 XESS.21(D15)
RS232-RD: D1.C R2.1 XESS.31(G5)
RS232-RTS: R3.1 XESS.26(F4)
RS232-TD: R1.1 XESS.41(J2)
RTS: IC3.7(T2OUT) RS-232.5 X1.8(-8:F)
RXD: IC3.8(R2IN) RS-232.4 X1.3(-3:F)
SCLK: IC17.5(B:Y3) SV1.10 SV2.10 ; also sheet 2
SD-CD#: J4.10(CD#) R4.1 XESS.4(H14)
SD-CLK: J4.5(CLK/SCLK) XESS.1(H16)
SD-CMD: J4.2(CMD/DI) XESS.45(K5)
SD-DAT0: J4.7(DAT0) XESS.66(M10)
SD-DAT1: J4.8(DAT1) XESS.67(P11)
SD-DAT2: J4.9(DAT2) XESS.68(T12)
SD-DAT3: J4.1(CD/DAT3) XESS.69(R12)
SD-WP: J4.12(WP) R5.1 XESS.5(H13)
SLOT1-CS#: SLOT1.37 XESS.18(E15)
SLOT1-IRQ: R21.1 XESS.84(J16)
SLOT2-CS#: SLOT2.37 XESS.19(D16)
SLOT2-IRQ: R22.1 XESS.83(J14)
TXD: IC3.13(R1IN) IC3.14(T1OUT) RS-232.2 X1.2(-2:F)
VCC [supply]: 5V.1 C1.1 C23.1 C24.1 ; also sheet 1,2
VDD [supply]: 3.3V.2 J4.4(VDD)
VSS [supply]: J3.1 J4.3(VSS) J4.6(VSS)
Unconnected: IC3.12(R1OUT) IDE.20 IDE.32 IDE.34 IDE.39 RS-232.1 SLOT1.34 SLOT2.34 SV1.2 SV1.4 SV2.2 SV2.4 X1.1(-1:F) X1.4(-4:F) X1.6(-6:F) X1.7(-7:F) X1.9(-9:F) XESS.6(G16) XESS.9(G13) XESS.11(CLKB) XESS.15(CS#) XESS.16(TCK) XESS.17(BSY) XESS.20(E14) XESS.25(D1) XESS.30(WR#) XESS.42(J3) XESS.46(L3) XESS.47(M1) XESS.48(M2) XESS.53 XESS.55(PROG#) XESS.63 XESS.64(CLKC) XESS.65 XESS.72 XESS.73 XESS.74 XESS.75 XESS.76 XESS.77(N15) XESS.79(L15) XESS.82(J13)

### Notes on the sheet
- Board Interconnect
- CPU and Peripherals

## Power pins joined to a net without a drawn wire
GND: IC1.8(GND) IC2.8(GND) IC3.15(GND) IC4.8(GND) IC5.8(GND) IC6.8(GND) IC7.8(GND) IC8.8(GND) IC9.8(GND) IC10.8(GND) IC11.8(GND) IC12.8(GND) IC13.8(GND) IC14.8(GND) IC15.8(GND) IC16.8(GND) IC17.10(P:GND) IC18.8(GND) IC19.7(P:GND) J4.13(GND) J4.14(GND)
VCC: IC1.16(VCC) IC2.16(VCC) IC3.16(VCC) IC4.16(VCC) IC5.16(VCC) IC6.16(VCC) IC7.16(VCC) IC8.16(VCC) IC9.16(VCC) IC10.16(VCC) IC11.16(VCC) IC12.16(VCC) IC13.16(VCC) IC14.16(VCC) IC15.16(VCC) IC16.16(VCC) IC17.20(P:VCC) IC18.16(VCC) IC19.14(P:VCC)

## Library data of the parts
2.5V = wirepad:1,6/0,8: THROUGH-HOLE PAD
3.3V 5V J3 = jumper:J: Bridge
+12V +V1-+V4 GND1-GND4 LOCKSW V- = dec-con:LUG: Spade Lug
A40 B40 C40 D40 E40 F40 = con-lstb:MA17-2: PIN HEADER; OC_FARNELL: unknown; OC_NEWARK: unknown
C1-C25 = rcl:C-US: CAPACITOR, American symbol
CONFIG = con-lstb:MA06-2: PIN HEADER; OC_FARNELL: unknown; OC_NEWARK: unknown
CONFIGSW = special:SW_DIP-9: DIP SWITCH
D1 D2 = diode:1N4728: Z DIODE 3.3 V, 1W, 5 percent
EXTRESET = switch-omron:40-XX: OMRON SWITCH; MF: OMRON COMPONENTS USA; MPN: B3F-4000; OC_FARNELL: 176434; OC_NEWARK: 36K3105
IC1 IC4-IC13 IC16 = 74xx-us:74*595: 8-bit SHIFT REGISTER, output latch
IC2 IC14 IC15 IC18 = 74xx-us:74*165: 8-bit parallel load SHIFT REGISTER
IC3 = maxim:MAX232: RS232 TRANSCEIVER; MF: MAXIM; MPN: MAX232ACPE+; OC_FARNELL: 9723773; OC_NEWARK: 68K4544
IC17 = 74xx-us:74*244: Octal BUFFER and LINE DRIVER, 3-state
IC19 = 74xx-us:74*00: Quad 2-input NAND gate
IDE SLOT1 SLOT2 = con-lstb:MA20-2: PIN HEADER; OC_FARNELL: unknown; OC_NEWARK: unknown
J1 = con-amp:FLOPPY-4: MATE N-LOCK Floppy / HDD conector Distributor: Bürklin 71F970
J4 = sdcards:SDCARD: SD Card Holder
R1-R139 = rcl:R-US_: RESISTOR, American symbol
RS-232 = con-lstb:MA05-1: PIN HEADER; OC_FARNELL: unknown; OC_NEWARK: unknown
SV1 SV2 = con-lstb:MA05-2: PIN HEADER; OC_FARNELL: unknown; OC_NEWARK: unknown
X1 = con-subd:F09HPS: SUB-D; OC_FARNELL: unknown; OC_NEWARK: unknown
XESS = xess:3S1000

## Net classes
1 supply: width 1.016 mm